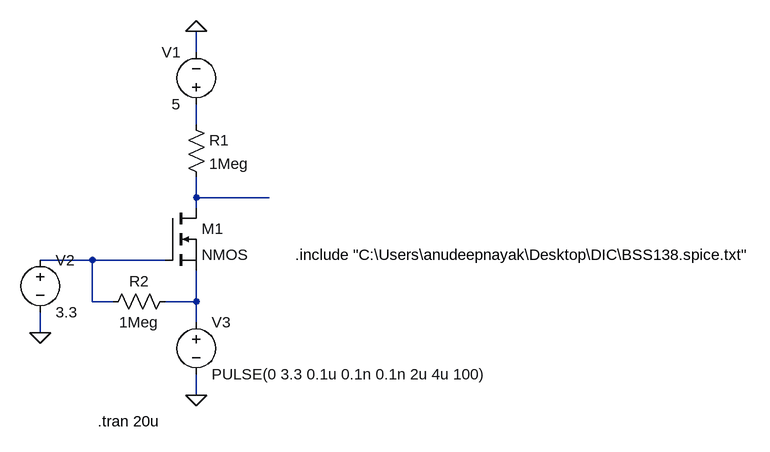
[diagram p0: schematic level_shifter.asc]
level_shifter.asc, the LTspice schematic file:
Version 4
SHEET 1 1092 680
WIRE 160 -128 160 -160
WIRE 160 -16 160 -48
WIRE 160 96 160 64
WIRE 272 96 160 96
WIRE 160 112 160 96
WIRE 0 192 -80 192
WIRE 112 192 0 192
WIRE 0 256 0 192
WIRE 32 256 0 256
WIRE 160 256 160 208
WIRE 160 256 112 256
WIRE 160 288 160 256
WIRE -80 304 -80 272
WIRE 160 400 160 368
FLAG 160 -160 0
FLAG -80 304 0
FLAG 160 400 0
SYMBOL nmos 112 112 R0
SYMATTR InstName M1
SYMBOL res 144 -32 R0
SYMATTR InstName R1
SYMATTR Value 1Meg
SYMBOL voltage 160 -32 R180
WINDOW 0 24 96 Left 2
WINDOW 3 24 16 Left 2
WINDOW 123 0 0 Left 0
WINDOW 39 0 0 Left 0
SYMATTR InstName V1
SYMATTR Value 5
SYMBOL voltage -80 176 R0
WINDOW 123 0 0 Left 0
WINDOW 39 0 0 Left 0
SYMATTR InstName V2
SYMATTR Value 3.3
SYMBOL voltage 160 272 R0
WINDOW 123 0 0 Left 0
WINDOW 39 0 0 Left 0
SYMATTR InstName V3
SYMATTR Value PULSE(0 3.3 0.1u 0.1n 0.1n 2u 4u 100)
SYMBOL res 128 240 R90
WINDOW 0 0 56 VBottom 2
WINDOW 3 32 56 VTop 2
SYMATTR InstName R2
SYMATTR Value 1Meg
TEXT 8 440 Left 2 !.tran 20u
TEXT 312 184 Left 2 !.include "C:\\Users\\anudeepnayak\\Desktop\\DIC\\BSS138.spice.txt"

The netlist it stands for:
* level_shifter.asc
M1 N002 N003 N004 N004 NMOS
R1 N001 N002 1Meg
V1 N001 0 5
V2 N003 0 3.3
V3 N004 0 PULSE(0 3.3 0.1u 0.1n 0.1n 2u 4u 100)
R2 N004 N003 1Meg
.model NMOS NMOS
.model PMOS PMOS
.lib standard.mos
.tran 20u
.include "C:\Users\anudeepnayak\Desktop\DIC\BSS138.spice.txt"
.backanno
.end